# EAGLE schematic 32ChannelExpander (EAGLE 6.4)
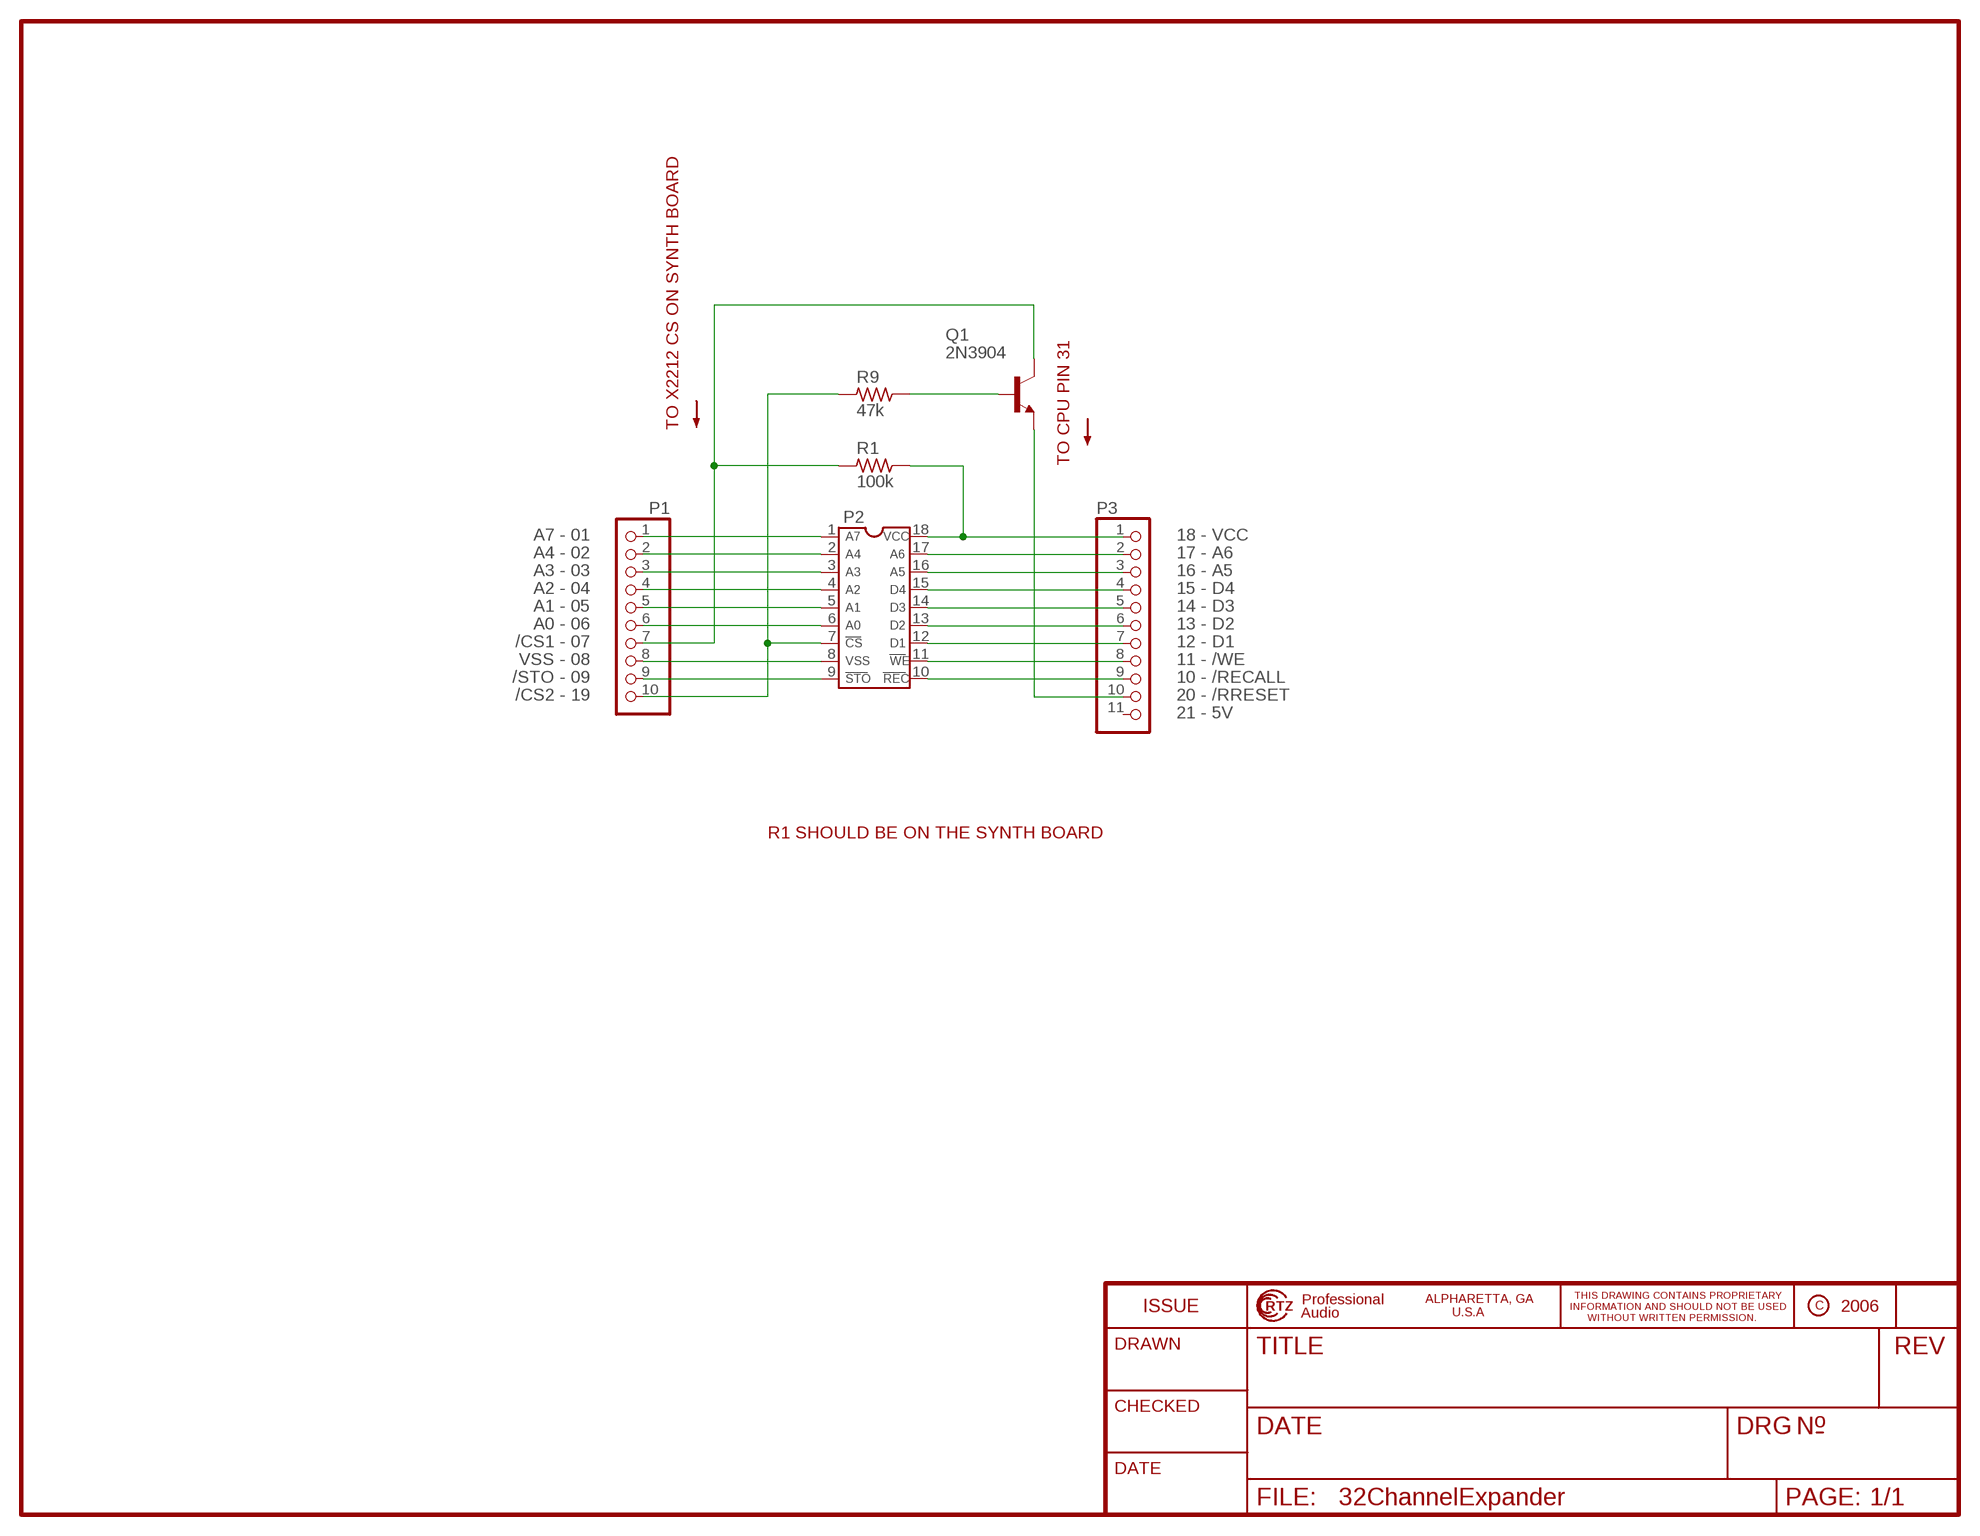
[diagram p0: schematic, sheet 1]

## Parts
P1  PINHD-1X10  [1X10]
P2  DIL18-NS  [DIL18-NS]
P3  PINHD-1X11  [1X11]
Q1  2N3904  [TO92]
R1  100k  R_0603  [R0603]
R9  47k  R_0603  [R0603]

## Nets
#CS1: P1.7 Q1.1(C) R1.1
#RECALL: P2.10 P3.9
#STORE: P1.9 P2.9
#WE: P2.11 P3.8
A0: P1.6 P2.6
A1: P1.5 P2.5
A2: P1.4 P2.4
A3: P1.3 P2.3
A4: P1.2 P2.2
A5: P2.16 P3.3
A6: P2.17 P3.2
A7: P1.1 P2.1
D1: P2.12 P3.7
D2: P2.13 P3.6
D3: P2.14 P3.5
D4: P2.15 P3.4
N$1: P3.10 Q1.3(E)
N$2: P1.8 P2.8
N$3: Q1.2(B) R9.2
N$4: P1.10 P2.7 R9.1
N$15 [VCC]: P2.18 P3.1 R1.2
Unconnected: P3.11

## Notes on the sheet
- TO X2212 CS ON SYNTH BOARD
- TO CPU PIN 31
- A7 - 01 | A7 | VCC | 18 - VCC
- A4 - 02 | A4 | A6 | 17 - A6
- A3 - 03 | A3 | A5 | 16 - A5
- A2 - 04 | A2 | D4 | 15 - D4
- A1 - 05 | A1 | D3 | 14 - D3
- A0 - 06 | A0 | D2 | 13 - D2
- /CS1 - 07 | CS | D1 | 12 - D1
- VSS - 08 | VSS | WE | 11 - /WE
- /STO - 09 | STO | REC | 10 - /RECALL
- /CS2 - 19 | 20 - /RRESET
- 21 - 5V
- R1 SHOULD BE ON THE SYNTH BOARD

## Library data of the parts
P1 = pinhead:PINHD-1X10: PIN HEADER
P2 = ic-package:DIL18: Dual In Line
P3 = pinhead:PINHD-1X11: PIN HEADER
Q1 = transistor-npn:2N3904: NPN Transistor
R1 R9 = rc-master:R_: RESISTOR

## Net classes
1 VCC: width 0.178 mm